# Altium schematic sheet LionIRVT-PMP15043-2.SchDoc
size A4; Date: Not shown in title block; ApprovedBy: Not shown in title block; CheckedBy: Not shown in title block; Author: Not shown in title block; CompanyName: Not shown in title block; Engineer: Not shown in title block; Organization: Not shown in title block; Address1: Not shown in title block; Address2: Not shown in title block; Address3: Not shown in title block; Address4: Not shown in title block; DocumentNumber: 1; Revision: Use project parameter SCH_Rev; SheetNumber: 3; SheetTotal: 3; PageSetup: Record=PageOptions|CenterHorizontal=True|CenterVertical=True|PrintScale=0.94|XCorrection=1.00|YCorrection=1.00|PrintKind=0|BorderSize=5000000|LeftOffset=0|BottomOffset=0|Orientation=2|PaperLength=1000|PaperWidth=1000|Scale=100|PaperSource=15|PrintQuality=600|MediaType=1|DitherType=10|PrintScaleMode=1|PaperKind=Letter; CurrentTime: Not shown in title block; CurrentDate: Not shown in title block; Time: Not shown in title block; DocumentFullPathAndName: Not shown in title block; DocumentName: Not shown in title block; ModifiedDate: Not shown in title block; ImagePath: Not shown in title block
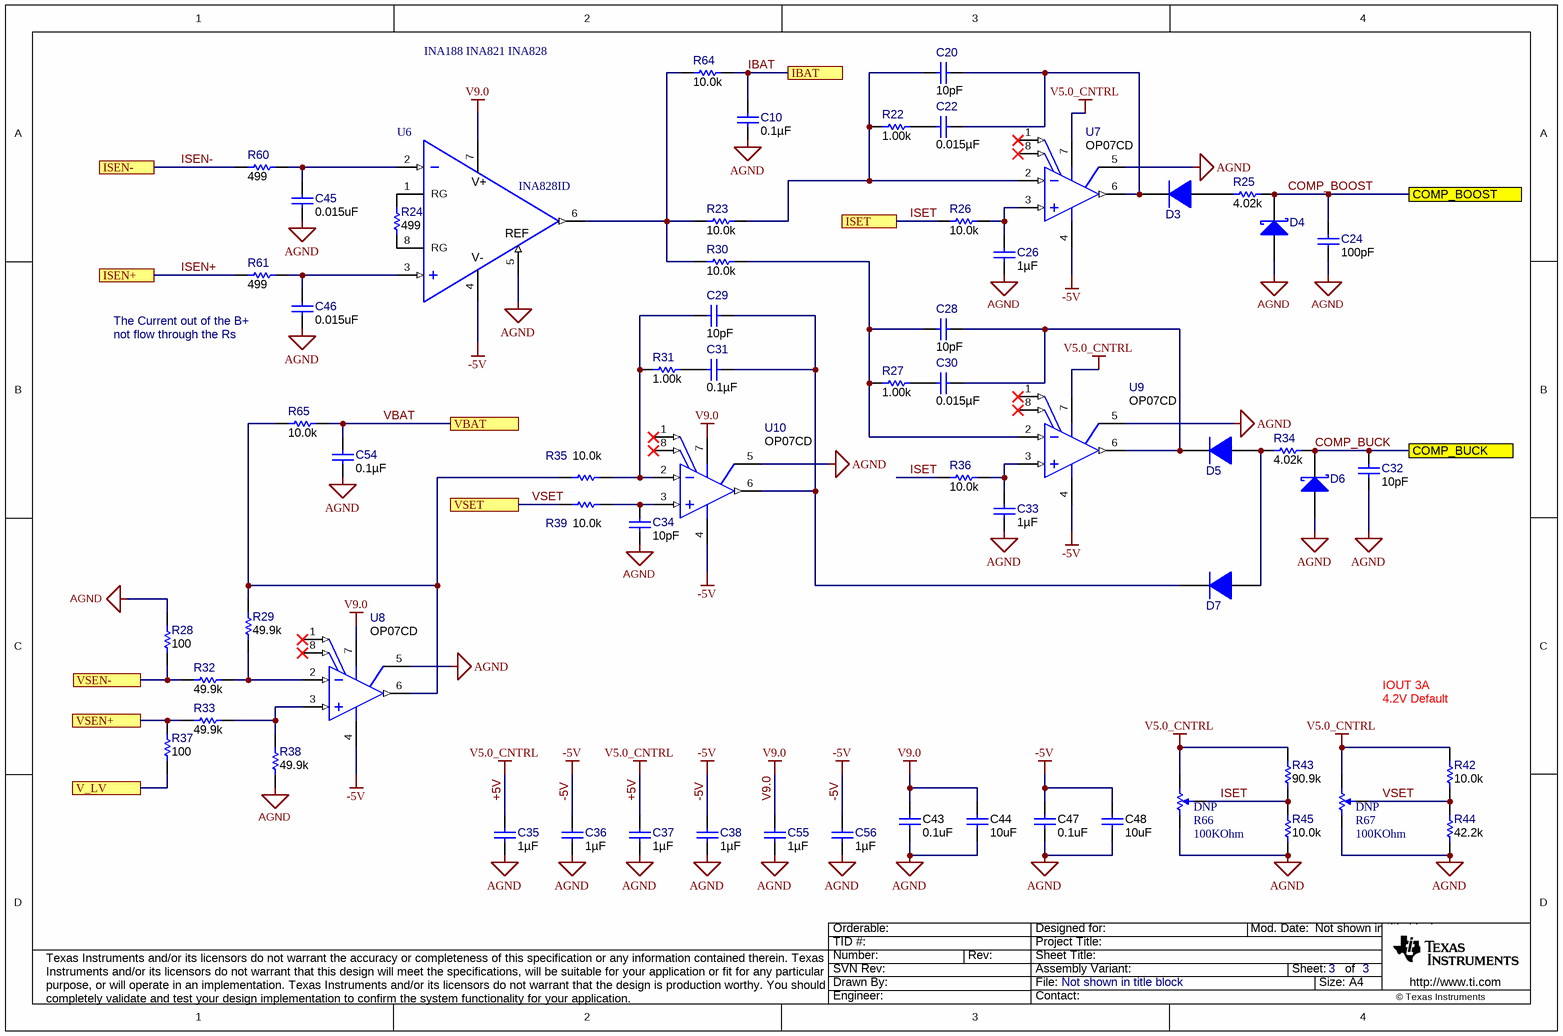
[diagram p0: LionIRVT-PMP15043-2.SchDoc]

## Parts
C10  ValueDisplayed: 0.1µF  [0402]  (hidden comment: GRM155R61C104KA88D)
C20  ValueDisplayed: 10pF  [0402]  (hidden comment: GRM1555C1H100JA01D)
C22  ValueDisplayed: 0.015µF  [0402]  (hidden comment: GRM155R71C153JA01D)
C24  ValueDisplayed: 100pF  [0402]  (hidden comment: GRM1555C1H101JA01D)
C26  ValueDisplayed: 1µF  [0402]  (hidden comment: GRM155R70J105KA12D)
C28  ValueDisplayed: 10pF  [0402]  (hidden comment: GRM1555C1H100JA01D)
C29  ValueDisplayed: 10pF  [0402]  (hidden comment: GRM1555C1H100JA01D)
C30  ValueDisplayed: 0.015µF  [0402]  (hidden comment: GRM155R71C153JA01D)
C31  ValueDisplayed: 0.1µF  [0402]  (hidden comment: GRM155R61C104KA88D)
C32  ValueDisplayed: 10pF  [0402]  (hidden comment: GRM1555C1H100JA01D)
C33  ValueDisplayed: 1µF  [0402]  (hidden comment: GRM155R70J105KA12D)
C34  ValueDisplayed: 10pF  [0402]  (hidden comment: GRM1555C1H100JA01D)
C35  ValueDisplayed: 1µF  [0402]  (hidden comment: GRM155R61A105KE15D)
C36  ValueDisplayed: 1µF  [0402]  (hidden comment: GRM155R61A105KE15D)
C37  ValueDisplayed: 1µF  [0402]  (hidden comment: GRM155R61A105KE15D)
C38  ValueDisplayed: 1µF  [0402]  (hidden comment: GRM155R61A105KE15D)
C43  ValueDisplayed: 0.1uF  [0603]  (hidden comment: Capacitor)
C44  ValueDisplayed: 10uF  [0805_HV]  (hidden comment: Capacitor)
C45  ValueDisplayed: 0.015uF  [0603]  (hidden comment: Capacitor)
C46  ValueDisplayed: 0.015uF  [0603]  (hidden comment: Capacitor)
C47  ValueDisplayed: 0.1uF  [0603]  (hidden comment: Capacitor)
C48  ValueDisplayed: 10uF  [0805_HV]  (hidden comment: Capacitor)
C54  ValueDisplayed: 0.1µF  [0402]  (hidden comment: GRM155R61C104KA88D)
C55  ValueDisplayed: 1µF  [0402]  (hidden comment: GRM155R61A105KE15D)
C56  ValueDisplayed: 1µF  [0402]  (hidden comment: GRM155R61A105KE15D)
D3  1N4148X-TP  [SOD-523]  (value not drawn)
D4  BAT54WS-7-F  [SOD-323]  (value not drawn)
D5  1N4148X-TP  [SOD-523]  (value not drawn)
D6  BAT54WS-7-F  [SOD-323]  (value not drawn)
D7  1N4148X-TP  [SOD-523]  (value not drawn)
R22  ValueDisplayed: 1.00k  [0402]  (hidden comment: CRCW04021K00FKED)
R23  ValueDisplayed: 10.0k  [0402]  (hidden comment: CRCW040210K0FKED)
R24  ValueDisplayed: 499  [0603]  (hidden comment: RC0603FR-07499RL)
R25  ValueDisplayed: 4.02k  [0402]  (hidden comment: CRCW04024K02FKED)
R26  ValueDisplayed: 10.0k  [0402]  (hidden comment: CRCW040210K0FKED)
R27  ValueDisplayed: 1.00k  [0402]  (hidden comment: CRCW04021K00FKED)
R28  ValueDisplayed: 100  [0402]  (hidden comment: CRCW0402100RFKED)
R29  ValueDisplayed: 49.9k  [0402]  (hidden comment: CRCW040251K1FKED)
R30  ValueDisplayed: 10.0k  [0402]  (hidden comment: CRCW040210K0FKED)
R31  ValueDisplayed: 1.00k  [0402]  (hidden comment: CRCW04021K00FKED)
R32  ValueDisplayed: 49.9k  [0402]  (hidden comment: CRCW040251K1FKED)
R33  ValueDisplayed: 49.9k  [0402]  (hidden comment: CRCW040251K1FKED)
R34  ValueDisplayed: 4.02k  [0402]  (hidden comment: CRCW04024K02FKED)
R35  ValueDisplayed: 10.0k  [0402]  (hidden comment: CRCW040210K0FKED)
R36  ValueDisplayed: 10.0k  [0402]  (hidden comment: CRCW040210K0FKED)
R37  ValueDisplayed: 100  [0402]  (hidden comment: CRCW0402100RFKED)
R38  ValueDisplayed: 49.9k  [0402]  (hidden comment: CRCW040251K1FKED)
R39  ValueDisplayed: 10.0k  [0402]  (hidden comment: CRCW040210K0FKED)
R42  ValueDisplayed: 10.0k  [0402]  (hidden comment: CRCW040210K0FKED)
R43  ValueDisplayed: 90.9k  [0402]  (hidden comment: CRCW040290K9FKED)
R44  ValueDisplayed: 42.2k  [0402]  (hidden comment: CRCW040242K2FKED)
R45  ValueDisplayed: 10.0k  [0402]  (hidden comment: CRCW040210K0FKED)
R60  ValueDisplayed: 499  [0603]  (hidden comment: Resistor)
R61  ValueDisplayed: 499  [0603]  (hidden comment: Resistor)
R64  ValueDisplayed: 10.0k  [0402]  (hidden comment: CRCW040210K0FKED)
R65  ValueDisplayed: 10.0k  [0402]  (hidden comment: CRCW040210K0FKED)
R66  Resistance: 100KOhm  [BOUR-TC33X-2_V]  (hidden comment: TC33X-2-104E)
R67  Resistance: 100KOhm  [BOUR-TC33X-2_V]  (hidden comment: TC33X-2-104E)
U6  INA828ID  [D0008A_N]
U7  OP07CD  [D0008A_N]
U8  OP07CD  [D0008A_N]
U9  OP07CD  [D0008A_N]
U10  OP07CD  [D0008A_N]

## Ports
COMP_BOOST, COMP_BUCK, IBAT, ISEN+, ISEN-, ISET, V_LV, VBAT, VSEN+, VSEN-, VSET

## Nets
+5V: C35.1 C37.1 R42.2 R43.2 R66.3 R67.3 U7.7(VCC+) U9.7(VCC+)  [also labelled V5.0_CNTRL]
-5V: C36.1 C38.1 C47.1 C48.1 C56.1 U6.4(V-) U7.4(VCC-) U8.4(VCC-) U9.4(VCC-) U10.4(VCC-)
AGND: C10.2 C24.2 C26.2 C32.2 C33.2 C34.2 C35.2 C36.2 C37.2 C38.2 C43.2 C44.2 C45.2 C46.2 C47.2 C48.2 C54.2 C55.2 C56.2 D4.2(A) D6.2(A) R28.2 R38.1 R44.1 R45.1 R66.1 R67.1 U6.5(REF) U7.5(NC) U8.5(NC) U9.5(NC) U10.5(NC)
V9.0: C43.1 C44.1 C55.1 U6.7(V+) U8.7(VCC+) U10.7(VCC+)
COMP_BOOST: C24.1 D4.1(K) R25.1 ; port COMP_BOOST
COMP_BUCK: C32.1 D6.1(K) R34.1 ; port COMP_BUCK
IBAT: C10.1 R64.2 ; port IBAT
ISEN+: R61.2 ; port ISEN+
ISEN-: R60.2 ; port ISEN-
ISET: R26.2 R36.2 R43.1 R45.2 R66.2 ; port ISET
V_LV: R37.1 ; port V_LV
VBAT: C54.1 R65.2 ; port VBAT
VSEN+: R33.1 R37.2 ; port VSEN+
VSEN-: R28.1 R32.1 ; port VSEN-
VSET: R39.2 R42.1 R44.2 R67.2 ; port VSET
NetC20_1: C20.1 C22.1 D3.1(K) U7.6(OUT)
NetC20_2: C20.2 R22.1 R23.1 U7.2(IN-)
NetC22_2: C22.2 R22.2
NetC26_1: C26.1 R26.1 U7.3(IN+)
NetC28_1: C28.1 C30.1 D5.1(K) U9.6(OUT)
NetC28_2: C28.2 R27.1 R30.2 U9.2(IN-)
NetC29_1: C29.1 C31.1 D7.1(K) U10.6(OUT)
NetC29_2: C29.2 R31.1 R35.2 U10.2(IN-)
NetC30_2: C30.2 R27.2
NetC31_2: C31.2 R31.2
NetC33_1: C33.1 R36.1 U9.3(IN+)
NetC34_1: C34.1 R39.1 U10.3(IN+)
NetC45_1: C45.1 R60.1 U6.2(IN-)
NetC46_1: C46.1 R61.1 U6.3(IN+)
NetD3_2: D3.2(A) R25.2
NetD5_2: D5.2(A) D7.2(A) R34.2
NetR23_2: R23.2 R30.1 R64.1 U6.6(OUT)
NetR24_1: R24.1 U6.8(RG)
NetR24_2: R24.2 U6.1(RG)
NetR29_1: R29.1 R32.2 U8.2(IN-)
NetR29_2: R29.2 R35.1 R65.1 U8.6(OUT)
NetR33_2: R33.2 R38.2 U8.3(IN+)

Not connected (* = marked no-connect by the designer): U7 1(OFFSET_N1)* 8(OFFSET_N2)*; U8 1(OFFSET_N1)* 8(OFFSET_N2)*; U9 1(OFFSET_N1)* 8(OFFSET_N2)*; U10 1(OFFSET_N1)* 8(OFFSET_N2)*

## Notes on the sheet
- INA188 INA821 INA828
- The Current out of the B+
- not flow through the Rs
- 4.2V Default
- IOUT 3A
- (near R66) DNP
- (near R67) DNP
- Drawn By:
- SVN Rev:
- Number:
- TID #:
- Orderable:
- Rev:
- Sheet Title:
- File:
- Project Title:
- Designed for:
- Assembly Variant:
- Mod. Date:
- Sheet:
- Size:
- of
- A4
- http://www.ti.com
- Texas Instruments and/or its licensors do not warrant the accuracy or completeness of this specification or any information contained therein. Texas Instruments and/or its licensors do not warrant that this design will meet the specifications, will be suitable for your application or fit for any particular purpose, or will operate in an implementation. Texas Instruments and/or its licensors do not warrant that the design is production worthy. You should completely validate and test your design implementation to confirm the system functionality for your application.
- Engineer:
- Contact:
- © Texas Instruments

## Library data of the parts
C10 C31 C54 = GRM155R61C104KA88D: CAP, CERM, 0.1 µF, 16 V, +/- 10%, X5R, 0402; Manufacturer: MuRata; Polarized: N; CompType: Capacitor; Value: 0.1uF; U/M: EA; Cap_F: 0.0000001; Tolerance_%: 10; Value1: Unknown; VDC_V: 16; Value2: 16V; TaMin_C: -55; TaMax_C: 85; AEC Category: Q200; SymbolVersion: 2008-07-09; PartNumber: GRM155R61C104KA88D; PackageReference: 0402; RoHS: Y; MountType: SMT; Technology: Ceramic; TempCo: X5R; Cap_Case: 0402; Published: 2008-06-19; Publisher: Texas Instruments; LatestRevisionDate: 2016-04-09; ComponentLink1Description: Datasheet link; ComponentLink1URL: http://search.murata.co.jp/Ceramy/PnsearchViewAction.do?HnOFG=ON&HnNFG=ON&SEL_CNT=50&sLang=en&sKey=GRM155R61C104KA88D&x=9&y=9&search=startwith; Supplier 1: Digi-Key; Supplier Part Number 1: 490-5415-1-ND; Supplier 2: Mouser; Supplier Part Number 2: 81-GRM155R61C104KA8D; AEC Qualified: ?
C20 C28 C29 C32 C34 = GRM1555C1H100JA01D: CAP, CERM, 10 pF, 50 V,+/- 5%, C0G/NP0, 0402; Manufacturer: MuRata; Polarized: N; CompType: Capacitor; Value: 10pF; U/M: EA; Cap_F: 0.00000000001; Tolerance_%: 5; Value1: Unknown; VDC_V: 50; Value2: 50V; TaMin_C: -55; TaMax_C: 125; SizeArea_mm2: 0.5; SizeAreaWB_mm2: 3; SizeX_mm: 1; SizeZ_mm: 0.6; AEC Category: Q200; Green_Lifecycle: Active; Green_REACh: Passed; SymbolVersion: 2008-07-09; PartNumber: GRM1555C1H100JA01D; PackageReference: 0402; RoHS: Y; MountType: SMT; Technology: Ceramic; TempCo: C0G/NP0; Cap_Case: 0402; SizeY_mm: 0.5; Published: 2008-06-19; Publisher: Texas Instruments; LatestRevisionDate: 2017-06-02; ComponentLink1Description: Datasheet link; ComponentLink1URL: http://search.murata.co.jp/Ceramy/PnsearchViewAction.do?HnOFG=ON&HnNFG=ON&SEL_CNT=50&sLang=en&sKey=GRM1555C1H100JA01D&x=9&y=9&search=startwith; Supplier 1: Mouser; Supplier Part Number 1: 81-GRM1555C1H100JA1D; AEC Qualified: ?; Green_EU RoHS: Passed; Green_EU RoHS-2: Incomplete
C22 C30 = GRM155R71C153JA01D: CAP, CERM, 0.015 µF, 16 V,+/- 5%, X7R, 0402; Manufacturer: MuRata; Polarized: N; CompType: Capacitor; Value: 0.015uF; U/M: EA; Cap_F: 0.000000015; Tolerance_%: 5; Value1: Unknown; VDC_V: 16; Value2: 16V; TaMin_C: -55; TaMax_C: 125; AEC Category: Q200; SizeArea_mm2: 0.5; SizeAreaWB_mm2: 3; SizeX_mm: 1; SizeZ_mm: 0.6; SymbolVersion: 2008-07-09; PartNumber: GRM155R71C153JA01D; PackageReference: 0402; RoHS: Y; MountType: SMT; Technology: Ceramic; TempCo: X7R; Cap_Case: 0402; Published: 2008-06-19; Publisher: Texas Instruments; LatestRevisionDate: 2017-06-02; ComponentLink1Description: Datasheet link; ComponentLink1URL: http://psearch.en.murata.com/capacitor/product/GRM155R71C153JA01%23.pdf; Supplier 1: Mouser; Supplier Part Number 1: 81-GRM155R71C153JA1D; AEC Qualified: N; AEC Grade: N/A; SizeY_mm: 0.5
C24 = GRM1555C1H101JA01D: CAP, CERM, 100 pF, 50 V,+/- 5%, C0G/NP0, 0402; Manufacturer: MuRata; Polarized: N; CompType: Capacitor; Value: 100pF; U/M: EA; Cap_F: 0.0000000001; Tolerance_%: 5; Value1: Unknown; VDC_V: 50; Value2: 50V; TaMin_C: -55; TaMax_C: 125; SizeArea_mm2: 0.5; SizeAreaWB_mm2: 3; SizeX_mm: 1; SizeZ_mm: 0.6; AEC Category: Q200; Green_Lifecycle: Active; Green_REACh: Passed; SymbolVersion: 2008-07-09; PartNumber: GRM1555C1H101JA01D; PackageReference: 0402; RoHS: Y; MountType: SMT; Technology: Ceramic; TempCo: C0G/NP0; Cap_Case: 0402; SizeY_mm: 0.5; Published: 2008-06-19; Publisher: Texas Instruments; LatestRevisionDate: 2017-06-02; ComponentLink1Description: Datasheet link; ComponentLink1URL: http://search.murata.co.jp/Ceramy/PnsearchViewAction.do?HnOFG=ON&HnNFG=ON&SEL_CNT=50&sLang=en&sKey=GRM1555C1H101JA01D&x=9&y=9&search=startwith; Supplier 1: Mouser; Supplier Part Number 1: 81-GRM1555C1H101JA1D; AEC Qualified: ?; Green_EU RoHS: Passed; Green_EU RoHS-2: Incomplete
C26 C33 = GRM155R70J105KA12D: CAP, CERM, 1 µF, 6.3 V,+/- 10%, X7R, 0402; Manufacturer: MuRata; Polarized: N; CompType: Capacitor; Value: 1uF; U/M: EA; Cap_F: 0.000001; Tolerance_%: 10; Value1: Unknown; VDC_V: 6.3; Value2: 6.3V; TaMin_C: -55; TaMax_C: 125; SizeArea_mm2: 0.5; SizeAreaWB_mm2: 3; SizeX_mm: 1; SizeZ_mm: 0.6; AEC Category: Q200; SymbolVersion: 2008-07-09; PartNumber: GRM155R70J105KA12D; PackageReference: 0402; RoHS: Y; MountType: SMT; Technology: Ceramic; TempCo: X7R; Cap_Case: 0402; SizeY_mm: 0.5; Published: 2008-06-19; Publisher: Texas Instruments; LatestRevisionDate: 2017-06-02; ComponentLink1Description: Datasheet link; ComponentLink1URL: http://search.murata.co.jp/Ceramy/image/img/A01X/G101/ENG/GRM155R70J105KA12-01.pdf; Supplier 1: Digi-Key; Supplier Part Number 1: 490-10024-1-ND; Supplier 2: Mouser; Supplier Part Number 2: 81-GRM155R70J105KA2D; Supplier 3: Farnell; Supplier Part Number 3: 2688505RL; AEC Qualified: N; AEC Grade: N/A
C35-C38 C55 C56 = GRM155R61A105KE15D: CAP, CERM, 1 µF, 10 V,+/- 10%, X5R, 0402; Manufacturer: MuRata; Polarized: N; CompType: Capacitor; Value: 1uF; U/M: EA; Cap_F: 0.000001; Tolerance_%: 10; Value1: Unknown; Value2: 10V; TaMin_C: -55; TaMax_C: 85; SizeArea_mm2: 0.5; SizeAreaWB_mm2: 3; SizeX_mm: 1; SizeZ_mm: 0.6; AEC Category: Q200; Green_Lifecycle: Active; Green_REACh: Passed; SymbolVersion: 2008-07-09; PartNumber: GRM155R61A105KE15D; PackageReference: 0402; RoHS: Y; VDC_V: 10; MountType: SMT; Technology: Ceramic; TempCo: X5R; Cap_Case: 0402; SizeY_mm: 0.5; Published: 2008-06-19; Publisher: Texas Instruments; LatestRevisionDate: 2017-06-02; ComponentLink1Description: Datasheet link; ComponentLink1URL: http://search.murata.co.jp/Ceramy/PnsearchViewAction.do?HnOFG=ON&HnNFG=ON&SEL_CNT=50&sLang=en&sKey=GRM155R61A105KE15D&x=9&y=9&search=startwith; Supplier 1: Digi-Key; Supplier Part Number 1: 490-3890-1-ND; Supplier 2: Mouser; Supplier Part Number 2: 81-GRM155R61A105KE15; Supplier 3: Farnell; Supplier Part Number 3: 1735523; AEC Qualified: ?; Green_EU RoHS: Passed; Green_EU RoHS-2: Incomplete
C43 C47 = CMP-0006752-5: CAP, CERM, 0.1 uF, 25 V, +/- 5%, X7R, 0603; PartNumber: 06033C104JAT2A; Manufacturer: AVX; Polarized: N; Value: 0.1uF; U/M: EA; Cap_F: 100nF; ESR_ohm: 0.05; Value1: 0.05 ohm; VDC_V: 25V; TaMin_C: -55°C; TaMax_C: 125°C; AEC Category: Q200; SizeArea_mm2: 1.28; SizeAreaWB_mm2: 4.68; SizeX_mm: 1.6; SizeY_mm: 0.8; SizeZ_mm: 1; CompType: Capacitor; PackageReference: 0603; RoHS: Y; Tolerance_%: 5%; Value2: 25V; MountType: SMT; Technology: Ceramic; TempCo: X7R; Cap_Case: 0603; Published: 2008-06-19; Publisher: Texas Instruments; LatestRevisionDate: 2017-03-09; ComponentLink1Description: Datasheet link; ComponentLink1URL: http://datasheets.avx.com/X7RDielectric.pdf; Supplier 1: Digi-Key; Supplier Part Number 1: 478-3713-1-ND; Supplier 2: Mouser; Supplier Part Number 2: 581-06033C104JAT2A; Supplier 3: Farnell; Supplier Part Number 3: 1740614; AEC Qualified: N; AEC Grade: N/A
C44 C48 = CMP-0008315-2: CAP, CERM, 10 uF, 10 V, +/- 10%, X7R, 0805; PartNumber: GRM21BR71A106KE51L; Manufacturer: MuRata; Polarized: N; Value: 10uF; U/M: EA; Cap_F: 10µF; ESR_ohm: 3m; Value1: 0.003 ohm; VDC_V: 10V; TaMin_C: -55°C; TaMax_C: 125°C; Cap_Case: 0805; AEC Category: Q200; SizeArea_mm2: 2.5; SizeAreaWB_mm2: 6.75; SizeX_mm: 2; SizeY_mm: 1.25; SizeZ_mm: 1.45; CompType: Capacitor; PackageReference: 0805; RoHS: Y; Tolerance_%: 10%; Value2: 10V; MountType: SMT; Technology: Ceramic; TempCo: X7R; Published: 2008-06-19; Publisher: Texas Instruments; LatestRevisionDate: 2017-03-09; ComponentLink1Description: Datasheet link; ComponentLink1URL: http://search.murata.co.jp/Ceramy/PnsearchViewAction.do?HnOFG=ON&HnNFG=ON&SEL_CNT=50&sLang=en&sKey=GRM21BR71A106KE51L&x=9&y=9&search=startwith; Supplier 1: Digi-Key; Supplier Part Number 1: 490-3905-1-ND; Supplier 2: Mouser; Supplier Part Number 2: 81-GRM21BR71A106KE51; Supplier 3: Farnell; Supplier Part Number 3: 1828828; AEC Qualified: ?
C45 C46 = CMP-0007383-5: CAP, CERM, 0.015 uF, 16 V, +/- 10%, X7R, 0603; PartNumber: GRM188R71C153KA01D; Manufacturer: MuRata; Polarized: N; U/M: EA; Cap_F: 15nF; Value1: Unknown; VDC_V: 16V; TaMin_C: -55°C; TaMax_C: 125°C; SizeArea_mm2: 1.28; SizeAreaWB_mm2: 4.68; SizeX_mm: 1.6; SizeY_mm: 0.8; SizeZ_mm: 1; AEC Category: Q200; CompType: Capacitor; Value: 0.015uF; PackageReference: 0603; RoHS: Y; Tolerance_%: 10%; Value2: 16V; MountType: SMT; Technology: Ceramic; TempCo: X7R; Cap_Case: 0603; Published: 2008-06-19; Publisher: Texas Instruments; LatestRevisionDate: 2017-03-09; ComponentLink1Description: Datasheet link; ComponentLink1URL: http://search.murata.co.jp/Ceramy/PnsearchViewAction.do?HnOFG=ON&HnNFG=ON&SEL_CNT=50&sLang=en&sKey=GRM188R71C153KA01D&x=9&y=9&search=startwith; Supplier 1: Mouser; Supplier Part Number 1: 81-GRM188R71C153KA; AEC Qualified: ?
D3 D5 D7 = 1N4148X-TP: Diode, Switching, 75 V, 0.3 A, SOD-523; Manufacturer: Micro Commercial Components; U/M: EA; Vf_V: 1.25; Value: 75V; Value1: 0.3A; Value2: 1.25V; Io_A: 0.3; Vr_V: 75; TJmax_C: 150; SizeAreaWB_mm2: 5.13; SizeArea_mm2: 1.53; SizeX_mm: 1.7; SizeY_mm: 0.9; SizeZ_mm: 0.65; AEC Category: Q101; Green_Lifecycle: Not Set; Green_REACh: Incomplete; SymbolVersion: 2008-12-08; PartNumber: 1N4148X-TP; PackageReference: SOD-523; CompType: Diode; MountType: SMT; Type: Switching; RoHS: Y; Published: 2008-06-26; Publisher: Texas Instruments; LatestRevisionDate: 2017-05-30; ComponentLink1Description: Datasheet link; ComponentLink1URL: http://www.mccsemi.com/up_pdf/1N4148X(SOD-523).PDF; Supplier 1: Digi-Key; Supplier Part Number 1: 1N4148XTPMSCT-ND; Supplier 2: Newark; Supplier Part Number 2: 69R6666; Supplier 3: Mouser; Supplier Part Number 3: 833-1N4148X-TP; AEC Qualified: ?; Green_EU RoHS: Incomplete; Green_EU RoHS-2: Incomplete
D4 D6 = BAT54WS-7-F: Diode, Schottky, 30 V, 0.2 A, SOD-323; Manufacturer: Diodes Inc.; U/M: EA; Vf_V: 0.7; Value: 30V; Value1: 0.2A; Value2: 0.7V; Io_A: 0.2; Vr_V: 30; TJmax_C: 125; SizeAreaWB_mm2: 8.695; SizeArea_mm2: 3.645; SizeX_mm: 2.7; SizeY_mm: 1.35; SizeZ_mm: 1; AEC Category: Q101; Green_Lifecycle: Active; Green_REACh: Passed; CompType: Diode; SymbolVersion: 2008-12-08; PartNumber: BAT54WS-7-F; PackageReference: SOD-323; MountType: SMT; Type: Schottky; RoHS: Y; Published: 2008-06-26; Publisher: Texas Instruments; LatestRevisionDate: 2017-05-30; ComponentLink1Description: Datasheet link; ComponentLink1URL: http://www.diodes.com/datasheets/ds30098.pdf; Supplier 1: Digi-Key; Supplier Part Number 1: BAT54WS-FDICT-ND; Supplier 2: Mouser; Supplier Part Number 2: 621-BAT54WS-F; Supplier 3: Farnell; Supplier Part Number 3: 1843687; AEC Qualified: ?; Green_EU RoHS: Passed; Green_EU RoHS-2: Passed
R22 R27 R31 = CRCW04021K00FKED: RES, 1.00 k, 1%, 0.063 W, 0402; Manufacturer: Vishay-Dale; CompType: Resistor; Value: 1.00k; Res_ohm: 1000; Value_Code: 1k00; Tolerance_%: 1; Power_W: 0.063; Value2: 0.063W; VDC_V: 50; TempCo: 100 ppm/C; SizeArea_mm2: 0.5; SizeZ_mm: 0.6; EIA_Code: E96; U/M: EA; AEC Category: Q200; SymbolVersion: 2009-05-29; PartNumber: CRCW04021K00FKED; PackageReference: 0402; RoHS: Y; Value1: 1%; MountType: SMT; Technology: Thick Film; SizeX_mm: 1; SizeY_mm: 0.5; Published: 2008-06-26; Publisher: Texas Instruments; LatestRevisionDate: 2017-03-21; ComponentLink1Description: Datasheet link; ComponentLink1URL: http://www.vishay.com/docs/20035/dcrcwe3.pdf; Supplier 1: Digi-Key; Supplier Part Number 1: 541-1.00KLCT-ND; Supplier 2: Newark; Supplier Part Number 2: 52K6545; Supplier 3: Mouser; Supplier Part Number 3: 71-CRCW0402-1.0K-E3; AEC Qualified: ?
R23 R26 R30 R35 R36 R39 R42 R45 R64 R65 = CRCW040210K0FKED: RES, 10.0 k, 1%, 0.063 W, 0402; Manufacturer: Vishay-Dale; CompType: Resistor; Value: 10.0k; Res_ohm: 10000; Value_Code: 10k0; Tolerance_%: 1; Power_W: 0.063; Value2: 0.063W; VDC_V: 50; TempCo: 100 ppm/C; SizeArea_mm2: 0.5; SizeZ_mm: 0.6; EIA_Code: E96; U/M: EA; AEC Category: Q200; SymbolVersion: 2009-05-29; PartNumber: CRCW040210K0FKED; PackageReference: 0402; RoHS: Y; Value1: 1%; MountType: SMT; Technology: Thick Film; SizeX_mm: 1; SizeY_mm: 0.5; Published: 2008-06-26; Publisher: Texas Instruments; LatestRevisionDate: 2017-03-21; ComponentLink1Description: Datasheet link; ComponentLink1URL: http://www.vishay.com/docs/20035/dcrcwe3.pdf; Supplier 1: Digi-Key; Supplier Part Number 1: 541-10.0KLCT-ND; Supplier 2: Newark; Supplier Part Number 2: 52K6595; Supplier 3: Mouser; Supplier Part Number 3: 71-CRCW0402-10K-E3; AEC Qualified: ?
R24 = RC0603FR-07499RL: RES, 499, 1%, 0.1 W, 0603; Manufacturer: Yageo America; CompType: Resistor; Value: 499; Value_Code: 499R; Tolerance_%: 1; Power_W: 0.1; Value2: 0.1W; VDC_V: 150; TempCo: 200 ppm/C; SizeArea_mm2: 1.28; SizeX_mm: 1.6; SizeY_mm: 0.8; EIA_Code: E96; U/M: EA; AEC Category: Q200; Green_Lifecycle: Active; Green_REACh: Passed; SymbolVersion: 2009-05-29; PartNumber: RC0603FR-07499RL; PackageReference: 0603; RoHS: Y; Res_ohm: 499; Value1: 1%; MountType: SMT; Technology: Thick Film; SizeZ_mm: 1; Published: 2008-06-26; Publisher: Texas Instruments; LatestRevisionDate: 2017-05-31; ComponentLink1Description: Datasheet link; ComponentLink1URL: http://www.yageo.com/pdf/Pu-RC0603_51_PbFree_L_2.pdf; Supplier 1: Digi-Key; Supplier Part Number 1: 311-499HRCT-ND; Supplier 2: Mouser; Supplier Part Number 2: 603-RC0603FR-07499RL; Supplier 3: Farnell; Supplier Part Number 3: 1799347; AEC Qualified: ?; Green_EU RoHS: Passed with Exemption; Green_EU RoHS-2: Passed
R25 R34 = CRCW04024K02FKED: RES, 4.02 k, 1%, 0.063 W, 0402; Manufacturer: Vishay-Dale; CompType: Resistor; Value: 4.02k; Res_ohm: 4020; Value_Code: 4k02; Tolerance_%: 1; Power_W: 0.063; Value2: 0.063W; VDC_V: 50; TempCo: 100 ppm/C; SizeArea_mm2: 0.5; SizeZ_mm: 0.6; EIA_Code: E96; U/M: EA; AEC Category: Q200; Green_Lifecycle: Active; Green_REACh: Passed; SymbolVersion: 2009-05-29; PartNumber: CRCW04024K02FKED; PackageReference: 0402; RoHS: Y; Value1: 1%; MountType: SMT; Technology: Thick Film; SizeX_mm: 1; SizeY_mm: 0.5; Published: 2008-06-26; Publisher: Texas Instruments; LatestRevisionDate: 2017-06-03; ComponentLink1Description: Datasheet link; ComponentLink1URL: http://www.vishay.com/docs/20035/dcrcwe3.pdf; Supplier 1: Digi-Key; Supplier Part Number 1: 541-4.02KLCT-ND; Supplier 2: Newark; Supplier Part Number 2: 52K7034; Supplier 3: Mouser; Supplier Part Number 3: 71-CRCW0402-4.02K-E3; AEC Qualified: ?; Green_EU RoHS: Passed with Exemption; Green_EU RoHS-2: Passed
R28 R37 = CRCW0402100RFKED: RES, 100, 1%, 0.063 W, 0402; Manufacturer: Vishay-Dale; CompType: Resistor; Value: 100; Value_Code: 100R; Tolerance_%: 1; Power_W: 0.063; Value2: 0.063W; VDC_V: 50; TempCo: 100 ppm/C; SizeArea_mm2: 0.5; SizeZ_mm: 0.6; EIA_Code: E96; U/M: EA; AEC Category: Q200; Green_Lifecycle: Active; Green_REACh: Passed; SymbolVersion: 2009-05-29; PartNumber: CRCW0402100RFKED; PackageReference: 0402; RoHS: Y; Res_ohm: 100; Value1: 1%; MountType: SMT; Technology: Thick Film; SizeX_mm: 1; SizeY_mm: 0.5; Published: 2008-06-26; Publisher: Texas Instruments; LatestRevisionDate: 2017-06-03; ComponentLink1Description: Datasheet link; ComponentLink1URL: http://www.vishay.com/docs/20035/dcrcwe3.pdf; Supplier 1: Digi-Key; Supplier Part Number 1: 541-100LCT-ND; Supplier 2: Newark; Supplier Part Number 2: 52K6609; Supplier 3: Mouser; Supplier Part Number 3: 71-CRCW0402-100-E3; AEC Qualified: ?; Green_EU RoHS: Passed with Exemption; Green_EU RoHS-2: Passed
R29 R32 R33 R38 = CRCW040251K1FKED: RES, 51.1 k, 1%, 0.063 W, 0402; Manufacturer: Vishay-Dale; CompType: Resistor; Value: 51.1k; Res_ohm: 51100; Value_Code: 51k1; Tolerance_%: 1; Power_W: 0.063; Value2: 0.063W; VDC_V: 50; TempCo: 100 ppm/C; SizeArea_mm2: 0.5; SizeZ_mm: 0.6; EIA_Code: E96; U/M: EA; AEC Category: Q200; Green_Lifecycle: Active; Green_REACh: Passed; SymbolVersion: 2009-05-29; PartNumber: CRCW040251K1FKED; PackageReference: 0402; RoHS: Y; Value1: 1%; MountType: SMT; Technology: Thick Film; SizeX_mm: 1; SizeY_mm: 0.5; Published: 2008-06-26; Publisher: Texas Instruments; LatestRevisionDate: 2017-06-03; ComponentLink1Description: Datasheet link; ComponentLink1URL: http://www.vishay.com/docs/20035/dcrcwe3.pdf; Supplier 1: Digi-Key; Supplier Part Number 1: 541-51.1KLCT-ND; Supplier 2: Newark; Supplier Part Number 2: 52K7131; Supplier 3: Mouser; Supplier Part Number 3: 71-CRCW0402-51.1K-E3; AEC Qualified: ?; Green_EU RoHS: Passed with Exemption; Green_EU RoHS-2: Passed
R43 = CRCW040290K9FKED: RES, 90.9 k, 1%, 0.063 W, 0402; Manufacturer: Vishay-Dale; CompType: Resistor; Value: 90.9k; Res_ohm: 90900; Value_Code: 90k9; Tolerance_%: 1; Power_W: 0.063; Value2: 0.063W; VDC_V: 50; TempCo: 100 ppm/C; SizeArea_mm2: 0.5; SizeZ_mm: 0.6; EIA_Code: E96; U/M: EA; AEC Category: Q200; Green_Lifecycle: Active; Green_REACh: Passed; SymbolVersion: 2009-05-29; PartNumber: CRCW040290K9FKED; PackageReference: 0402; RoHS: Y; Value1: 1%; MountType: SMT; Technology: Thick Film; SizeX_mm: 1; SizeY_mm: 0.5; Published: 2008-06-26; Publisher: Texas Instruments; LatestRevisionDate: 2017-06-03; ComponentLink1Description: Datasheet link; ComponentLink1URL: http://www.vishay.com/docs/20035/dcrcwe3.pdf; Supplier 1: Digi-Key; Supplier Part Number 1: 541-90.9KLCT-ND; Supplier 2: Newark; Supplier Part Number 2: 52K7338; Supplier 3: Mouser; Supplier Part Number 3: 71-CRCW0402-90.9K-E3; AEC Qualified: ?; Green_EU RoHS: Passed with Exemption; Green_EU RoHS-2: Passed
R44 = CRCW040242K2FKED: RES, 42.2 k, 1%, 0.063 W, 0402; Manufacturer: Vishay-Dale; CompType: Resistor; Value: 42.2k; Res_ohm: 42200; Value_Code: 42k2; Tolerance_%: 1; Power_W: 0.063; Value2: 0.063W; VDC_V: 50; TempCo: 100 ppm/C; SizeArea_mm2: 0.5; SizeZ_mm: 0.6; EIA_Code: E96; U/M: EA; AEC Category: Q200; SymbolVersion: 2009-05-29; PartNumber: CRCW040242K2FKED; PackageReference: 0402; RoHS: Y; Value1: 1%; MountType: SMT; Technology: Thick Film; SizeX_mm: 1; SizeY_mm: 0.5; Published: 2008-06-26; Publisher: Texas Instruments; LatestRevisionDate: 2017-06-03; ComponentLink1Description: Datasheet link; ComponentLink1URL: http://www.vishay.com/docs/20035/dcrcwe3.pdf; Supplier 1: Digi-Key; Supplier Part Number 1: 541-42.2KLCT-ND; Supplier 2: Newark; Supplier Part Number 2: 52K7062; Supplier 3: Mouser; Supplier Part Number 3: 71-CRCW0402-42.2K-E3; AEC Qualified: ?
R60 R61 = CMP-0022446-5: RES, 499, 1%, 0.1 W, AEC-Q200 Grade 0, 0603; PartNumber: CRCW0603499RFKEA; Manufacturer: Vishay-Dale; Value: 499; Value_Code: 499R; Power_W: 100mW; Value2: 0.1W; VDC_V: 75V; TempCo: 100 ppm/C; SizeArea_mm2: 1.28; SizeX_mm: 1.6; SizeY_mm: 0.8; SizeZ_mm: 1; EIA_Code: E96; AEC Category: Q200; AEC Qualified: Y; AEC Grade: 0; CompType: Resistor; PackageReference: 0603; RoHS: E; Res_ohm: 499; Tolerance_%: 1%; Value1: 1%; MountType: SMT; Technology: Thick Film; ComponentLink1Description: Datasheet link; ComponentLink1URL: http://www.vishay.com/docs/20035/dcrcwe3.pdf; Supplier 1: Digi-Key; Supplier Part Number 1: 541-499HCT-ND; Supplier 2: Newark; Supplier Part Number 2: 52K8569; Supplier 3: Mouser; Supplier Part Number 3: 71-CRCW0603-499-E3
R66 = CMP-2100-03695-1: Trimming Potentiometer, 100000 Ohm, -40 to 100 degC, 3-Pin SMD, RoHS, Tape and Reel; Manufacturer: Bourns; Tolerance: 25%; Max Power Dissipation: 100mW; Number of Turns: 1; Temperature Coefficient: 250ppm/degreesC; Voltage Rating (DC): 50V; Datasheet URL: http://www.bourns.com/docs/Product-Datasheets/TC33.pdf; Composition: Potentiometer; Package Description: 3-Pin Surface Mount Device, Body 3.8 x 3.6 mm; Weight: 29.4mg; Power Rating: 100mW; Termination: FootPrint; Manufacturer URL: http://www.bourns.com/; Width: 0.118inch; Height: 0.047inch; Military Standard: Not; Radiation Hardening: No; Colour: Silver; Case/Package: SMD/SMT; Depth: 3.8mm; Min Operating Temperature: -40degC; Lead Free: LeadFree; Datasheet Version: 42583.0; REACH SVHC: NoSVHC; Length: 3mm; RoHSCompliant: true; Contact Plating: Silver; Taper: Linear; Packaging: TapeandReel; Mount: SurfaceMount; Max Operating Temperature: 100degC; Package Reference: TC33X-2; Package Quantity: 2500
R67 = CMP-2100-03695-1: Trimming Potentiometer, 100k Ohm, -40 to 100 degC, 3-Pin SMD, RoHS, Tape and Reel; Manufacturer: Bourns; Tolerance: 25%; Max Power Dissipation: 100mW; Number of Turns: 1; Temperature Coefficient: 250ppm/degreesC; Voltage Rating (DC): 50V; Datasheet URL: http://www.bourns.com/docs/Product-Datasheets/TC33.pdf; Composition: Potentiometer; Package Description: 3-Pin Surface Mount Device, Body 3.8 x 3.6 mm; Weight: 29.4mg; Power Rating: 100mW; Termination: FootPrint; Manufacturer URL: http://www.bourns.com/; Width: 0.118inch; Height: 0.047inch; Military Standard: Not; Radiation Hardening: No; Colour: Silver; Case/Package: SMD/SMT; Depth: 3.8mm; Min Operating Temperature: -40degC; Lead Free: LeadFree; Datasheet Version: 42583.0; REACH SVHC: NoSVHC; Length: 3mm; RoHSCompliant: true; Contact Plating: Silver; Taper: Linear; Packaging: TapeandReel; Mount: SurfaceMount; Max Operating Temperature: 100degC; Package Reference: TC33X-2; Package Quantity: 2500
U6 = CMP-0079943-1: 50-uV Offset, 7-nV/√Hz Noise, Low-Power, Precision Instrumentation Amplifier, D0008A (SOIC-8); Alternate PartNumber: INA828IDR; Alternate Manufacturer: Texas Instruments; SizeAreaWB_mm2: 56.58; SizeZ_mm: 1.75; SizeX_mm: 4.9; SizeY_mm: 6.2; SizeArea_mm2: 30.38; CompType: IC; AEC Qualified: N; AEC Category: Q200; ComponentLink1URL: http://www.ti.com/lit/ds/symlink/ina828.pdf; PackageDescription: SOIC-8; RoHS: Y; MountType: SMT; ComponentLink2URL: http://www.ti.com/product/ina828; ComponentLink3Description: Online Datasheet; ComponentLink2Description: Product Folder; Manufacturer: Texas Instruments; ComponentLink3URL: http://www.ti.com/product/ina828/datasheet; PackageReference: D0008A; PartNumber: INA828ID; ComponentLink1Description: Datasheet Link
U7-U10 = OP07CD: Low-Offset Voltage Operational Amplifier, 6 to 36 V, 0 to 70 degC, 8-pin SOIC (D0008A), Green (RoHS & no Sb/Br); Alternate Manufacturer: Texas Instruments; Alternate PartNumber: Equivalent; CMRR(Min)(dB): 100; GBW(Typ)(MHz): 0.6; IIB(Max)(pA): 7000; Iq per channel(Max)(mA): 5; Number of Channels: 1; Offset Drift(Typ)(uV/C): 0.5; Rating: Catalog; Slew Rate(Typ)(V/us): 0.3; Sub Family: General Purpose Amplifier, High Supply Voltage Amplifier (>=30V), Low Noise Amp (<=10nV/rtHz), Low Offset Voltage Amplifier (<=500uV); Total Supply Voltage(Max)(+5V is 5, +/-5V is 10): 36; Total Supply Voltage(Min)(+5V is 5, +/-5V is 10): 6; Vio (25C)(Max)(mV): 0.15; Vn at 1kHz(Typ)(nV/rtHz): 9.8; DatasheetVersion: SLOS099E; PackageVersion: 4040047-3/M, 06/2011; PackageReference: D0008A; PackageDescription: 8-Pin Plastic Small Outline, Body 4.9 x 3.9 mm, Pitch 1.27 mm; Supplier 1: Digi-Key; Supplier Part Number 1: 296-12852-5-ND; Supplier 2: Farnell; Supplier Part Number 2: 9589929; Supplier 3: Newark; Supplier Part Number 3: 67K2808; Supplier 4: Mouser; Supplier Part Number 4: 595-OP07CD; Eco-Plan: Green (RoHS & no Sb/Br); MountType: SMT; Code_JEDEC: MS-012; PartNumber: OP07CD; ComponentLink1Description: Manufacturer URL; ComponentLink1URL: http://www.ti.com/; ComponentLink2Description: Datasheet; ComponentLink2URL: http://www.ti.com/lit/ds/symlink/op07c.pdf; ComponentLink3Description: Package Specification; ComponentLink3URL: http://www.ti.com/litv/pdf/msoi002j; Manufacturer: Texas Instruments